# EasyEDA Pro project 5轴PCB-V1.1--捷配.eprj, schematic 原理图

## Sheets
1 主控MCU: Board Name: 控制板; Create Date: 2024-04-22; Page Name: 主控MCU; Project Name: 5轴PCB-V1.1--捷配; Schematic Name: 原理图; Update Date: 2025-03-28; Company: 嘉立创EDA; Page Size: A3; Version: V1.0
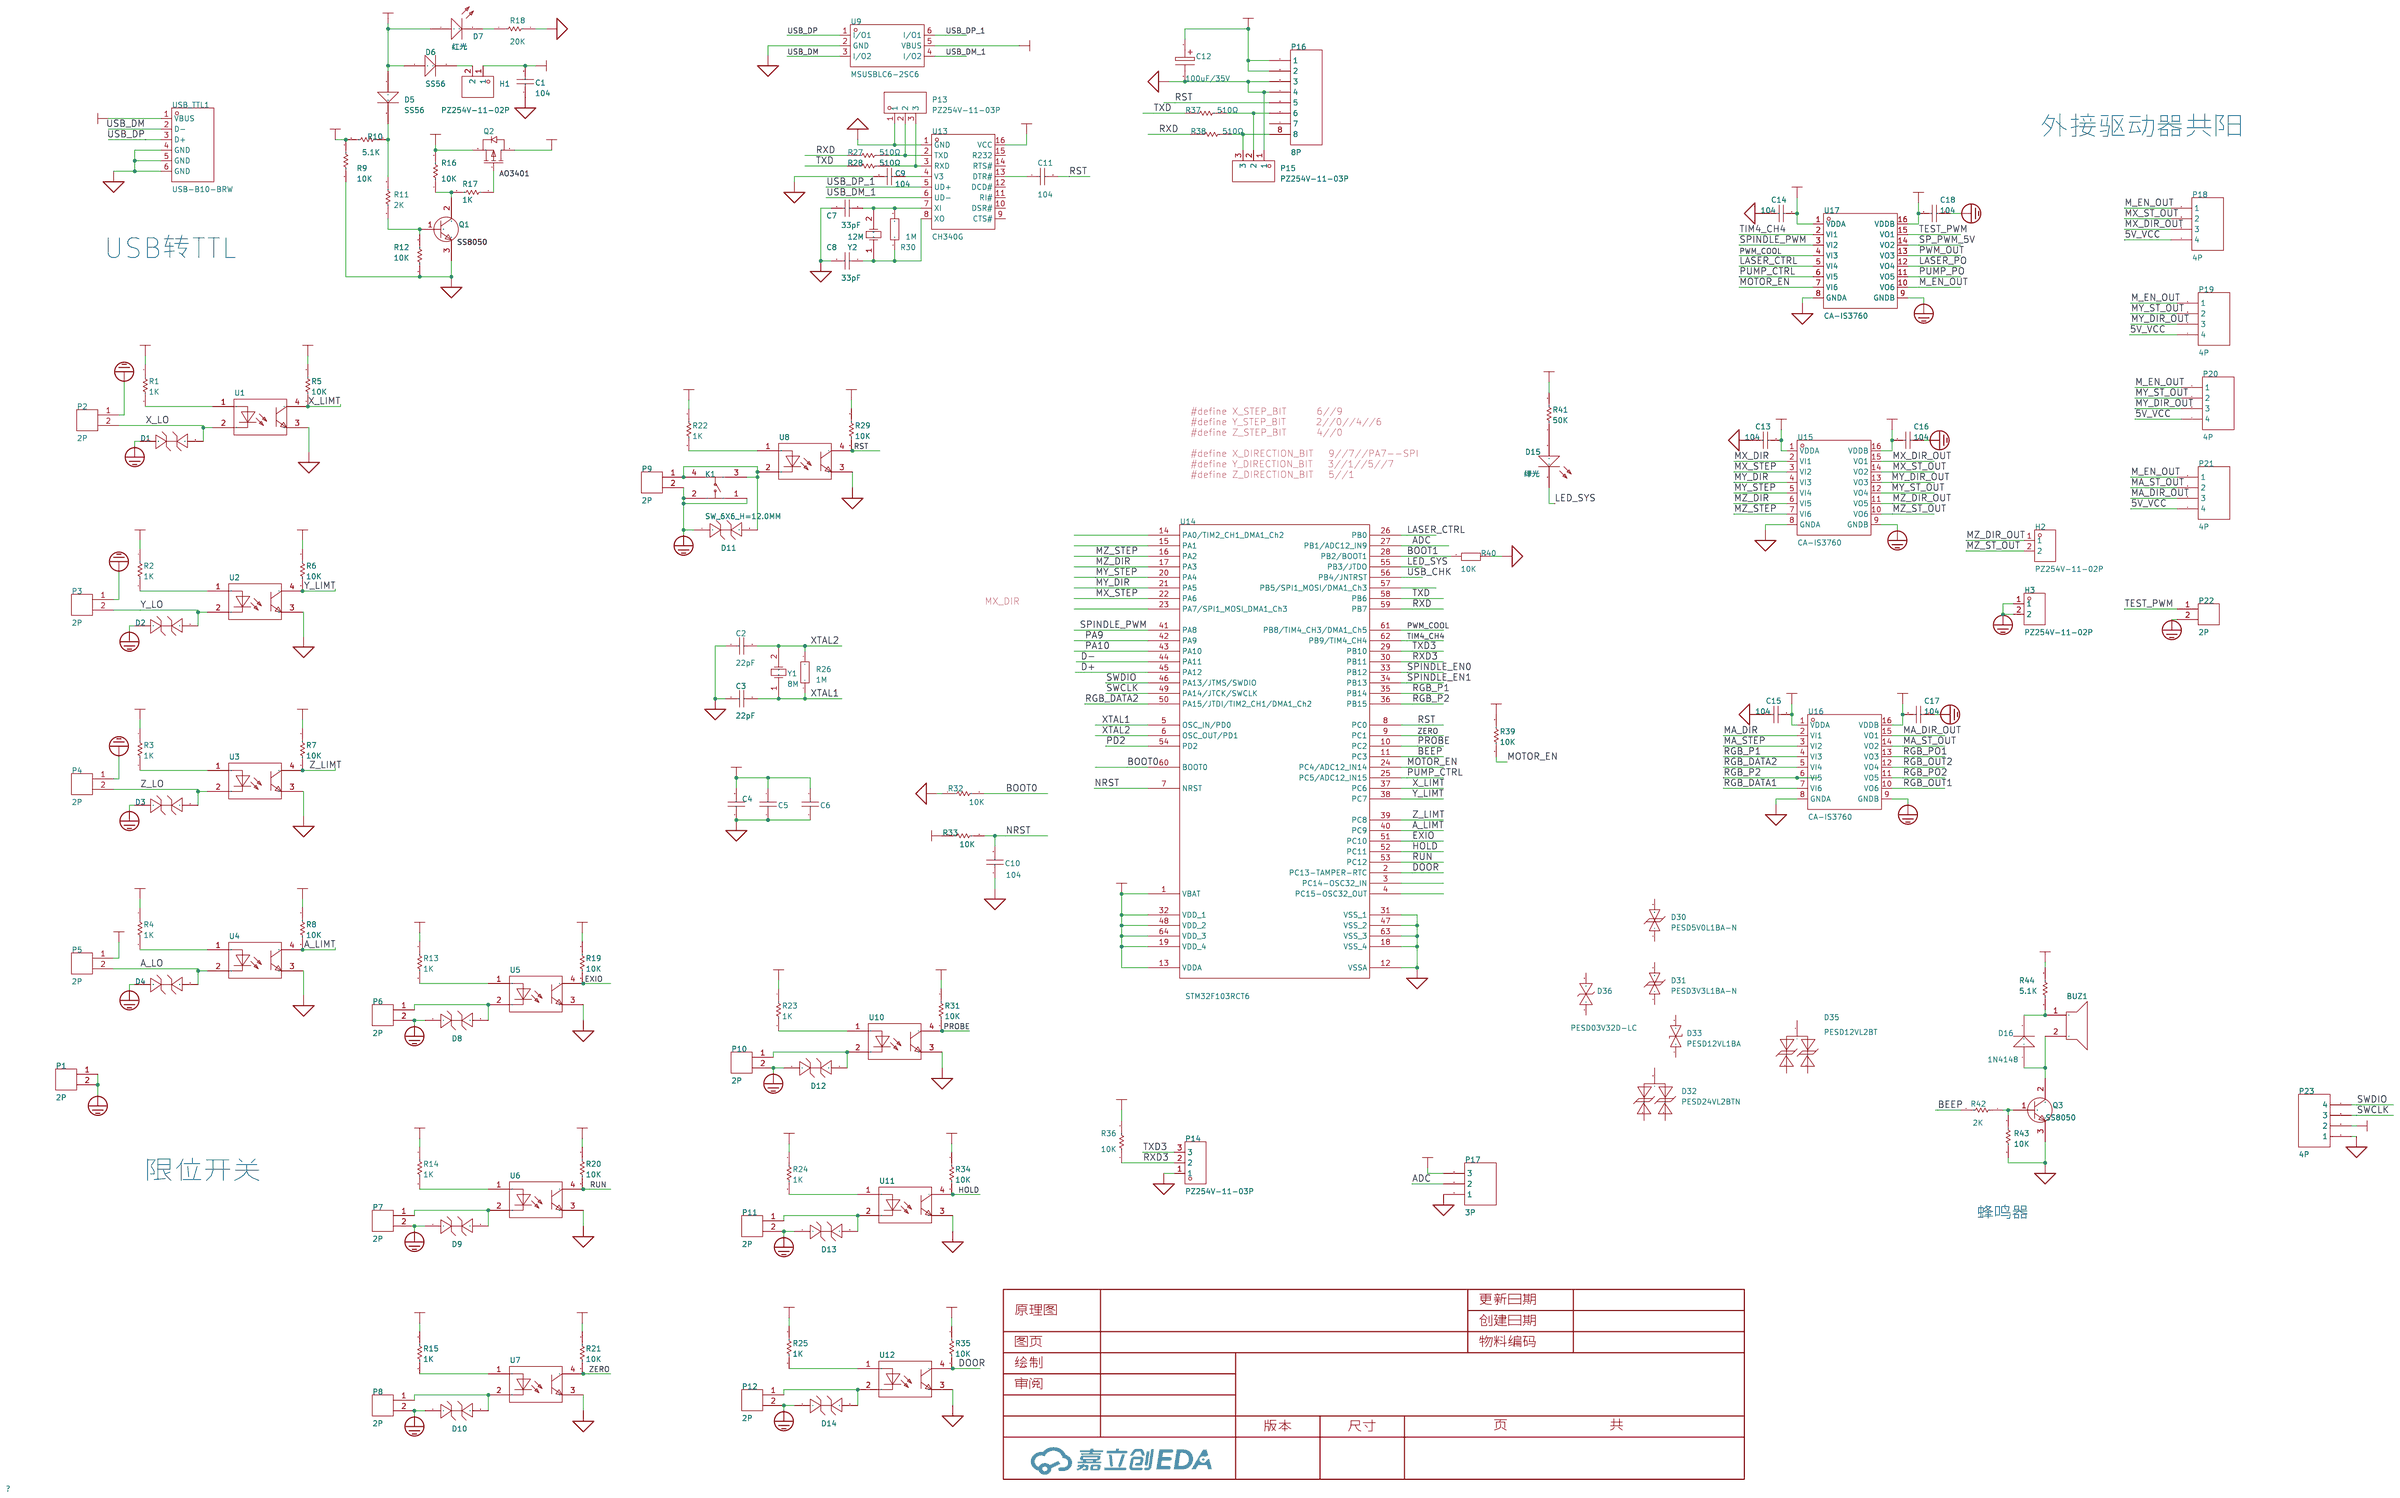
[diagram p0: 主控MCU]
2 电源及控制: Create Date: 2024-12-30; Page Name: 电源及控制; Update Date: 2025-01-02
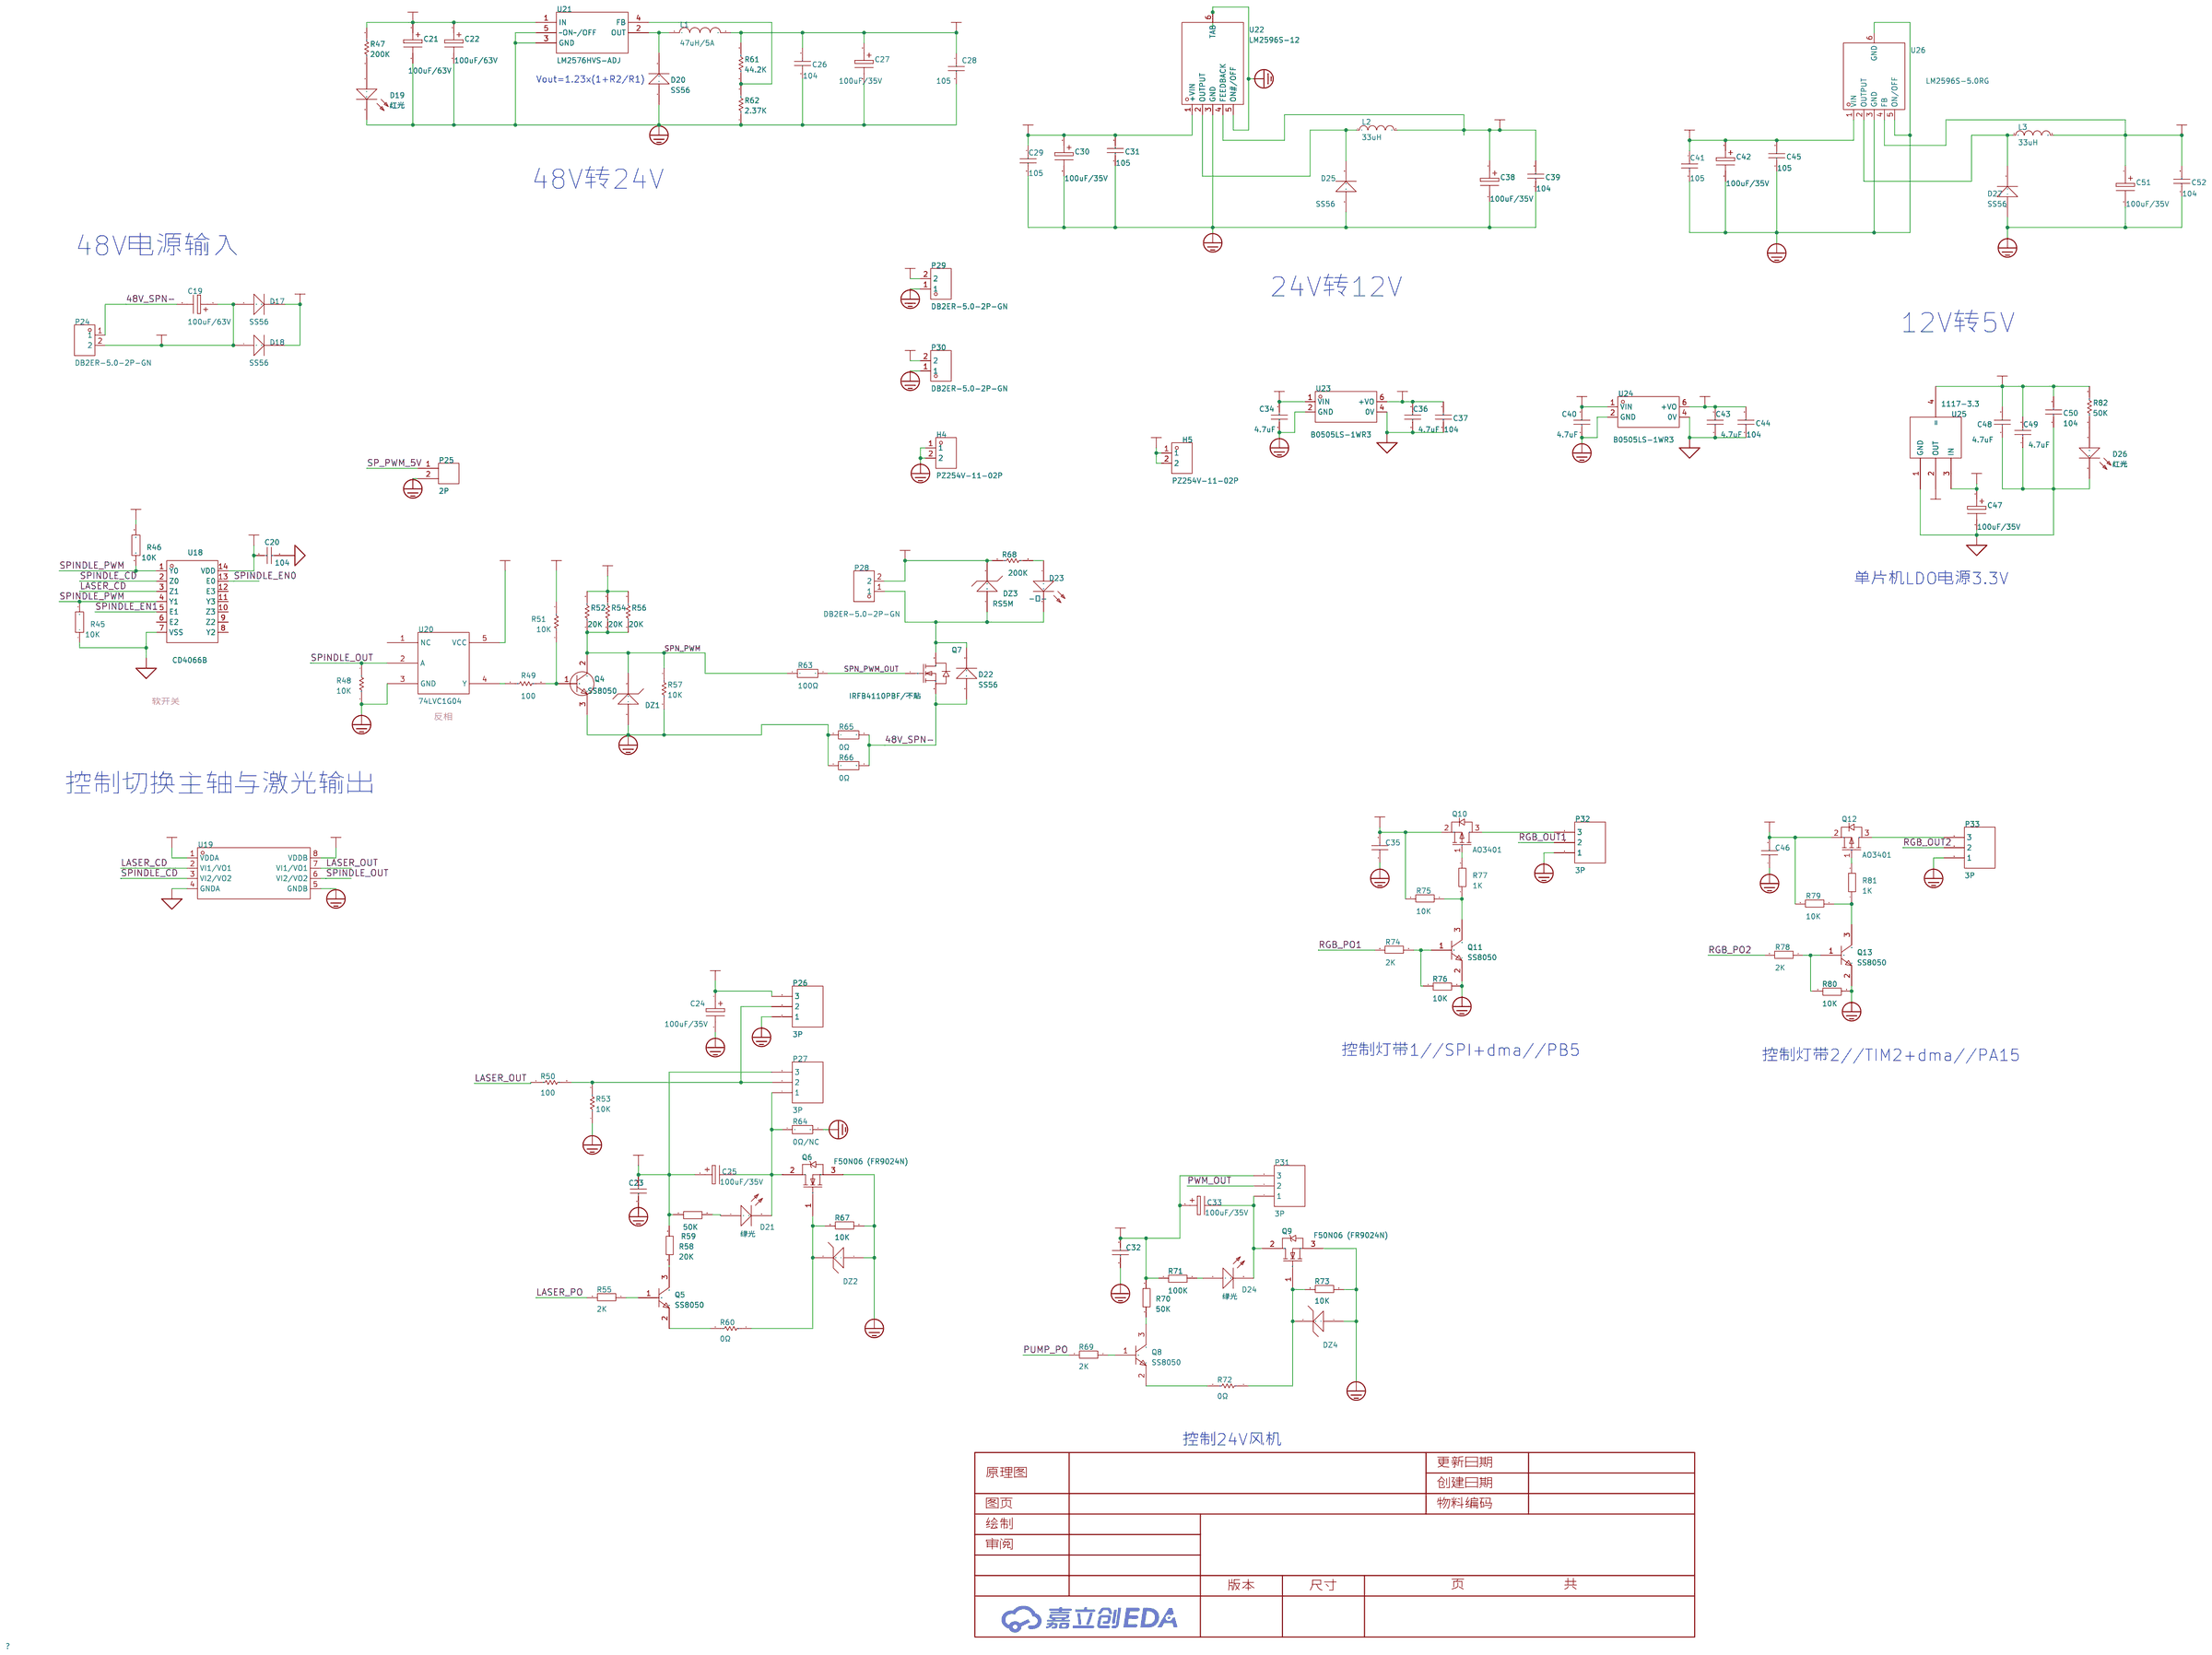
[diagram p1: 电源及控制]

## Parts
sheet 主控MCU
BUZ1  HNR-1255PA5.0  [BUZ-TH_BD12.5-P5.00-D0.9]
C1  104  [0603C]
C2  100pF  [0603C]
C3  100pF  [0603C]
C4  104  [0603C]
C5  104  [0603C]
C6  104  [0603C]
C7  18pF  [0603C]
C8  18pF  [0603C]
C9  104  [0603C]
C10  104  [0603C]
C11  104  [0805C]
C12  100uF/35V  [电解电容贴片6X6]
C13  104  [0603C]
C14  104  [0603C]
C15  104  [0603C]
C16  104  [0603C]
C17  104  [0603C]
C18  104  [0603C]
D1  ESD05V52D-C  [SOD-523_L1.2-W0.8-LS1.6-BI]
D2  ESD05V52D-C  [SOD-523_L1.2-W0.8-LS1.6-BI]
D3  ESD05V52D-C  [SOD-523_L1.2-W0.8-LS1.6-BI]
D4  ESD05V52D-C  [SOD-523_L1.2-W0.8-LS1.6-BI]
D5  SS56  [SMA]
D6  SS56  [SMA]
D7  红光  [0603LED]
D8  ESD05V52D-C  [SOD-523_L1.2-W0.8-LS1.6-BI]
D9  ESD05V52D-C  [SOD-523_L1.2-W0.8-LS1.6-BI]
D10  ESD05V52D-C  [SOD-523_L1.2-W0.8-LS1.6-BI]
D11  ESD05V52D-C  [SOD-523_L1.2-W0.8-LS1.6-BI]
D12  ESD05V52D-C  [SOD-523_L1.2-W0.8-LS1.6-BI]
D13  ESD05V52D-C  [SOD-523_L1.2-W0.8-LS1.6-BI]
D14  ESD05V52D-C  [SOD-523_L1.2-W0.8-LS1.6-BI]
D15  绿光  [0603LED]
D16  1N4148  [SMA]
D30  PESD5V0L1BA-N  [SOD-523_L1.2-W0.8-LS1.6-BI]
D31  PESD3V3L1BA-N  [SOD-523_L1.2-W0.8-LS1.6-BI]
D32  PESD24VL2BTN  [SOT-23-3_L2.9-W1.6-P1.90-LS2.8-BR]
D33  PESD12VL1BA  [SOD-323_L1.8-W1.3-LS2.5-BI]
D35  PESD12VL2BT  [SOT-23-3_L3.0-W1.7-P0.95-LS2.9-BR]
D36  PESD03V32D-LC  [SOD-323_L1.7-W1.3-LS2.5-BI]
H1  PZ254V-11-02P  [HDR-TH_2P-P2.54-V-M]
H2  PZ254V-11-02P  [HDR-TH_2P-P2.54-V-M]
H3  PZ254V-11-02P  [HDR-TH_2P-P2.54-V-M]
K1  SW_6X6_H=12.0MM  [KEY-SMD_4P-L6.0-W6.0-P4.50-LS9.0]
P1  2P  [HDR1X2_CON]
P2  2P  [HDR1X2_CON]
P3  2P  [HDR1X2_CON]
P4  2P  [HDR1X2_CON]
P5  2P  [HDR1X2_CON]
P6  2P  [HDR1X2_CON]
P7  2P  [HDR1X2_CON]
P8  2P  [HDR1X2_CON]
P9  2P  [HDR1X2_CON]
P10  2P  [HDR1X2_CON]
P11  2P  [HDR1X2_CON]
P12  2P  [HDR1X2_CON]
P13  PZ254V-11-03P  [HDR-TH_3P-P2.54-V-M]
P14  PZ254V-11-03P  [HDR-TH_3P-P2.54-V-M]
P15  PZ254V-11-03P  [HDR-TH_3P-P2.54-V-M]
P16  8P  [IDC8]
P17  3P  [HDR1X3_CON]
P18  4P  [HDR1X4_CON]
P19  4P  [HDR1X4_CON]
P20  4P  [HDR1X4_CON]
P21  4P  [HDR1X4_CON]
P22  2P  [HDR1X2_CON]
P23  4P  [SIP4]
Q1  SS8050  [SOT-23]
Q2  AO3401  [SOT-23-3_L3.0-W1.7-P0.95-LS2.9-BR]
Q3  SS8050  [SOT-23]
R1  1K  [0603R]
R2  1K  [0603R]
R3  1K  [0603R]
R4  1K  [0603R]
R5  10K  [0603R]
R6  10K  [0603R]
R7  10K  [0603R]
R8  10K  [0603R]
R9  10K  [0603R]
R10  5.1K  [0603R]
R11  2K  [0603R]
R12  10K  [0603R]
R13  1K  [0603R]
R14  1K  [0603R]
R15  1K  [0603R]
R16  10K  [0603R]
R17  1K  [0603R]
R18  20K  [0603R]
R19  10K  [0603R]
R20  10K  [0603R]
R21  10K  [0603R]
R22  1K  [0603R]
R23  1K  [0603R]
R24  1K  [0603R]
R25  1K  [0603R]
R26  1M  [R0603]
R27  510Ω  [0603R]
R28  510Ω  [0603R]
R29  10K  [0603R]
R30  1M  [R0603]
R31  10K  [0603R]
R32  10K  [0603R]
R33  10K  [0603R]
R34  10K  [0603R]
R35  10K  [0603R]
R36  10K  [0603R]
R37  510Ω  [0603R]
R38  510Ω  [0603R]
R39  10K  [0603R]
R40  10K  [0603R]
R41  50K  [0603R]
R42  2K  [0603R]
R43  10K  [0603R]
R44  5.1K  [0603R]
U1  LTV-357T-C  [SOP-4_L4.4-W3.9-P2.54-LS7.0-TL]
U2  LTV-357T-C  [SOP-4_L4.4-W3.9-P2.54-LS7.0-TL]
U3  LTV-357T-C  [SOP-4_L4.4-W3.9-P2.54-LS7.0-TL]
U4  LTV-357T-C  [SOP-4_L4.4-W3.9-P2.54-LS7.0-TL]
U5  LTV-357T-C  [SOP-4_L4.4-W3.9-P2.54-LS7.0-TL]
U6  LTV-357T-C  [SOP-4_L4.4-W3.9-P2.54-LS7.0-TL]
U7  LTV-357T-C  [SOP-4_L4.4-W3.9-P2.54-LS7.0-TL]
U8  LTV-357T-C  [SOP-4_L4.4-W3.9-P2.54-LS7.0-TL]
U9  MSUSBLC6-2SC6  [SOT-23-6_L2.9-W1.6-P0.95-LS2.8-BL]
U10  LTV-357T-C  [SOP-4_L4.4-W3.9-P2.54-LS7.0-TL]
U11  LTV-357T-C  [SOP-4_L4.4-W3.9-P2.54-LS7.0-TL]
U12  LTV-357T-C  [SOP-4_L4.4-W3.9-P2.54-LS7.0-TL]
U13  CH340G  [SOIC-16_L9.9-W3.9-P1.27-LS6.0-BL]
U14  STM32F103RCT6  [LQFP-64_L10.0-W10.0-P0.50-LS12.0-BL]
U15  CA-IS3760  [SOIC-16_L9.9-W3.9-P1.27-LS6.0-BL]
U16  CA-IS3760  [SOIC-16_L9.9-W3.9-P1.27-LS6.0-BL]
U17  CA-IS3760  [SOIC-16_L9.9-W3.9-P1.27-LS6.0-BL]
USB_TTL1  USB-B10-BRW  [USB-B-TH_USB-B10-BRW]
Y1  8M  [晶振贴片]
Y2  12M  [晶振贴片49SSMD]
sheet 电源及控制
C19  100uF/63V  [电解电容贴片10x10]
C20  104  [0603C]
C21  100uF/63V  [电解电容贴片10x10]
C22  100uF/63V  [电解电容贴片10x10]
C23  104  [0603C]
C24  100uF/35V  [电解电容贴片6X6]
C25  100uF/35V  [电解电容贴片6X6]
C26  104  [0805C]
C27  100uF/35V  [电解电容贴片6X6]
C28  105  [0805C]
C29  105  [0805C]
C30  100uF/35V  [电解电容贴片6x6]
C31  105  [0805C]
C32  104  [0603C]
C33  100uF/35V  [电解电容贴片6X6]
C34  4.7uF  [C0805]
C35  104  [0603C]
C36  4.7uF  [C0805]
C37  104  [C0603]
C38  100uF/35V  [电解电容贴片6x6]
C39  104  [C0603]
C40  4.7uF  [C0805]
C41  105  [C0603]
C42  100uF/35V  [电解电容贴片6x6]
C43  4.7uF  [C0805]
C44  104  [C0603]
C45  105  [C0603]
C46  104  [0603C]
C47  100uF/35V  [电解电容贴片6X6]
C48  4.7uF  [C0805]
C49  4.7uF  [C0805]
C50  104  [0603C]
C51  100uF/35V  [电解电容贴片6x6]
C52  104  [C0603]
D17  SS56  [SMA]
D18  SS56  [SMA]
D19  红光  [0603LED]
D20  SS56  [SMA]
D21  绿光  [0603LED]
D22  SS56  [SMA]
D23  -̹-  [0603LED]
D24  绿光  [0603LED]
D25  SS56  [SMA]
D26  红光  [0603LED]
D27  SS56  [SMA]
DZ1  --ѹ------SMAZ10V  [SMA]
DZ2  --ѹ------SMAZ10V  [SMA]
DZ3  RS5M  [SMC]
DZ4  --ѹ------SMAZ10V  [SMA]
H4  PZ254V-11-02P  [HDR-TH_2P-P2.54-V-M]
H5  PZ254V-11-02P  [HDR-TH_2P-P2.54-V-M]
L1  47uH/5A  [IND-SMD_L13.45-W12.6]
L2  33uH  [IND-SMD_L13.45-W12.6]
L3  33uH  [IND-SMD_L7.0-W7.0_SMDRI74-330MT]
P24  DB2ER-5.0-2P-GN  [CONN-TH_2P-P5.00_DB2ER-5.0-2P-GN]
P25  2P  [HDR1X2_CON]
P26  3P  [HDR1X3_CON]
P27  3P  [HDR1X3_CON]
P28  DB2ER-5.0-2P-GN  [CONN-TH_2P-P5.00_DB2ER-5.0-2P-GN]
P29  DB2ER-5.0-2P-GN  [CONN-TH_2P-P5.00_DB2ER-5.0-2P-GN]
P30  DB2ER-5.0-2P-GN  [CONN-TH_2P-P5.00_DB2ER-5.0-2P-GN]
P31  3P  [HDR1X3_CON]
P32  3P  [HDR1X3_CON]
P33  3P  [HDR1X3_CON]
Q4  SS8050  [SOT-23]
Q5  SS8050  [SOT-23]
Q6  F50N06 (FR9024N)  [TO-252]
Q7  IRFB4110PBF/不贴  [TO-220-3_L10.0-W4.5-P2.54-L]
Q8  SS8050  [SOT-23]
Q9  F50N06 (FR9024N)  [TO-252]
Q10  AO3401  [SOT-23]
Q11  SS8050  [SOT-23]
Q12  AO3401  [SOT-23]
Q13  SS8050  [SOT-23]
R45  10K  [R0603]
R46  10K  [R0603]
R47  10K  [0603R]
R48  10K  [0603R]
R49  100  [0603R]
R50  100  [0603R]
R51  10K  [0603R]
R52  20K  [0603R]
R53  10K  [0603R]
R54  20K  [0603R]
R55  2K  [0603R]
R56  20K  [0603R]
R57  10K  [0603R]
R58  20K  [0603R]
R59  50K  [0603R]
R60  0Ω  [0603R]
R61  44.2K  [0603R]
R62  2.37K  [0603R]
R63  100Ω  [R0603]
R64  0Ω/NC  [R1210]
R65  0Ω  [R1210]
R66  0Ω  [R1210]
R67  10K  [0603R]
R68  200K  [0603R]
R69  2K  [0603R]
R70  50K  [0603R]
R71  100K  [0603R]
R72  0Ω  [0603R]
R73  10K  [0603R]
R74  2K  [0603R]
R75  10K  [0603R]
R76  10K  [0603R]
R77  1K  [0603R]
R78  2K  [0603R]
R79  10K  [0603R]
R80  10K  [0603R]
R81  1K  [0603R]
R82  50K  [0603R]
U18  CD4066B  [SOP-14_L8.6-W3.9-P1.27-LS6.0-BL]
U19  CA-IS3720LS  [SOIC-8_L4.9-W3.9-P1.27-LS6.0-BL]
U20  74LVC1G04  [SOT-23-5]
U21  LM2576HVS-ADJ  [TO-263]
U22  LM2596S-12  [TO-263-5_L10.2-W8.6-P1.70-LS14.4-BR]
U23  B0505LS-1WR3  [PWRM-TH_BXXXXLS-1WR3]
U24  B0505LS-1WR3  [PWRM-TH_BXXXXLS-1WR3]
U25  1117-3.3  [SOT-223]
U26  LM2596S-5.0RG  [TO-263-5_L10.1-W8.7-P1.70-LS15.2-BR]

## Library data of the parts
BUZ1 = HNR-1255PA5.0: Supplier Part: C22387764; Manufacturer: 华能; Supplier Footprint: 插件,D=12.5mm; Datasheet: https://atta.szlcsc.com/upload/public/pdf/source/20240511/4CF3735ACB8587B052B696B4D6D2AF15.pdf; Supplier: LCSC
C1 C20 C50 = 104: Capacitor (Semiconductor SIM Model); Published: 8-Jun-2000; LatestRevisionDate: 17-Jul-2002; LatestRevisionNote: Re-released for DXP Platform.; PackageReference: C1206; Publisher: Altium Limited; Origin Footprint 2: C1206; Origin Footprint 3: 0402; Origin Footprint 4: 1310[0504]; Origin Footprint 5: 1608[0603]; Origin Footprint 6: C1210; Origin Footprint 7: C0805; Origin Footprint 8: C1206; Origin Footprint 9: 0805; Origin Footprint 10: 0805L; Design Item ID: Cap Semi; Library Name: Miscellaneous Devices
C2 C3 = 22pF: Capacitor (Semiconductor SIM Model); Published: 8-Jun-2000; LatestRevisionDate: 17-Jul-2002; LatestRevisionNote: Re-released for DXP Platform.; PackageReference: C1206; Publisher: Altium Limited; Origin Footprint 2: C1206; Origin Footprint 3: 0402; Origin Footprint 4: 1310[0504]; Origin Footprint 5: 1608[0603]; Origin Footprint 6: C1210; Origin Footprint 7: C0805; Origin Footprint 8: C1206; Origin Footprint 9: 0805; Origin Footprint 10: 0805L; Origin Footprint 11: 0805C; Design Item ID: Cap Semi; Library Name: Miscellaneous Devices
C4-C6 C23 C32 C35 C46 = 104: Origin Footprint 2: CAP; Origin Footprint 3: 0805C; Design Item ID: CAP; Library Name: SCH封装库
C7 C8 = 33pF: Capacitor (Semiconductor SIM Model); Published: 8-Jun-2000; LatestRevisionDate: 17-Jul-2002; LatestRevisionNote: Re-released for DXP Platform.; PackageReference: C1206; Publisher: Altium Limited; Origin Footprint 2: C1206; Origin Footprint 3: 0402; Origin Footprint 4: 1310[0504]; Origin Footprint 5: 1608[0603]; Origin Footprint 6: C1210; Origin Footprint 7: C0805; Origin Footprint 8: C1206; Origin Footprint 9: 0805; Origin Footprint 10: 0805L; Design Item ID: Cap Semi; Library Name: Miscellaneous Devices
C9 = 103: Capacitor (Semiconductor SIM Model); Published: 8-Jun-2000; LatestRevisionDate: 17-Jul-2002; LatestRevisionNote: Re-released for DXP Platform.; PackageReference: C1206; Publisher: Altium Limited; Origin Footprint 2: C1206; Origin Footprint 3: 0402; Origin Footprint 4: 1310[0504]; Origin Footprint 5: 1608[0603]; Origin Footprint 6: C1210; Origin Footprint 7: C0805; Origin Footprint 8: C1206; Origin Footprint 9: 0805; Origin Footprint 10: 0805L; Design Item ID: Cap Semi; Library Name: Miscellaneous Devices
C10 C13-C18 = 104: Capacitor (Semiconductor SIM Model); Published: 8-Jun-2000; LatestRevisionDate: 17-Jul-2002; LatestRevisionNote: Re-released for DXP Platform.; PackageReference: C1206; Publisher: Altium Limited; Origin Footprint 2: C1206; Origin Footprint 3: 0402; Origin Footprint 4: 1310[0504]; Origin Footprint 5: 1608[0603]; Origin Footprint 6: C1210; Origin Footprint 7: C0805; Origin Footprint 8: C1206; Origin Footprint 9: 0805; Origin Footprint 10: 0805L; Origin Footprint 11: 0805C; Design Item ID: Cap Semi; Library Name: Miscellaneous Devices
C11 = 104: Capacitor (Semiconductor SIM Model); Published: 8-Jun-2000; LatestRevisionDate: 17-Jul-2002; LatestRevisionNote: Re-released for DXP Platform.; PackageReference: C1206; Publisher: Altium Limited; Origin Footprint 2: C1206; Origin Footprint 3: 0402; Origin Footprint 4: 1310[0504]; Origin Footprint 5: 1608[0603]; Origin Footprint 6: C1210; Origin Footprint 7: C0805; Origin Footprint 8: C1206; Origin Footprint 9: 0805; Origin Footprint 10: 0805L; Origin Footprint 1: 0603C; Design Item ID: Cap Semi; Library Name: Miscellaneous Devices
C12 C24 C25 C27 C33 C47 = 100uF/35V: Origin Footprint 2: X47U; Origin Footprint 1: 电解电容贴片6x6; Design Item ID: ELECTRO1; Library Name: *
D1-D4 D8-D14 = ESD05V52D-C: 极性：双向 反向截止电压(Vrwm)：5V 击穿电压(VBR)：5.6V 钳位电压(Vc)@Ipp：15V 反向截止电压(Vrwm)：5V 击穿电压(最小值)：5.6V 峰值脉冲电流(Ipp)@tp=8/20μs：5A 最大钳位电压：15V; Supplier Part: C727170; Manufacturer: TWGMC(台湾迪嘉); Supplier Footprint: SOD-523; JLCPCB Part Class: 扩展库; Datasheet: https://atta.szlcsc.com/upload/public/pdf/source/20200827/C727170_700AFDE065FF081A69A0C04747B3686A.pdf; Supplier: LCSC
D5 D6 D17 D18 D20 = SS56: Design Item ID: 1N4148; Library Name: SCH封装库
D7 D19 D26 = 红光: Origin Footprint 2: LED(小); Design Item ID: LED; Library Name: SCH封装库
D15 D21 D24 = 绿光: Origin Footprint 2: LED(小); Design Item ID: LED; Library Name: SCH封装库
D16 = 4148: Library Name: SCH封装库
D30 D31 = PESD5V0S1BBN: 极性:Bidirectional;反向关断电压（典型值）:5V (Max);击穿电压（最小值）:6V;箝位电压:15V;峰值脉冲电流（10/1000us）:5A (8/20us);; Supplier Part: C314264; Manufacturer: BORN伯恩半导体; Supplier Footprint: SOD-523; JLCPCB Part Class: Extended Part; Datasheet: https://atta.szlcsc.com/upload/public/pdf/source/20181015/C314264_F9AC5761AC2631DA841FBD1D9C6821E3.pdf; Supplier: LCSC; Polarity: Bidirectional; Voltage - Reverse Standoff (Typ): 5V (Max); Voltage - Breakdown (Min): 6V; Voltage - Clamping (Max) @ Ipp: 15V; Current - Peak Pulse (10/1000μs): 5A (8/20us)
D32 = PESD24VL2BTN: 极性:Bidirectional;反向关断电压（典型值）:24V (Max);击穿电压（最小值）:26.7V;箝位电压:48V;峰值脉冲电流（10/1000us）:6A (8/20us);; Supplier Part: C314266; Manufacturer: BORN伯恩半导体; Supplier Footprint: SOT-23; JLCPCB Part Class: Extended Part; Datasheet: https://atta.szlcsc.com/upload/public/pdf/source/20181015/C314266_827961A24CE19193E9C29A410C67A84F.pdf; Supplier: LCSC; Polarity: Bidirectional; Voltage - Reverse Standoff (Typ): 24V (Max); Voltage - Breakdown (Min): 26.7V; Voltage - Clamping (Max) @ Ipp: 48V; Current - Peak Pulse (10/1000μs): 6A (8/20us)
D33 = PESD12VL1BA: 极性:Bidirectional;峰值脉冲电流（10/1000us）:15A (8/20us);箝位电压:35V;击穿电压（最小值）:13.3V;反向关断电压（典型值）:12V (Max);; LCSC Part Name: ESD二极管 PESD12VL1BA; Supplier Part: C323796; Supplier Footprint: SOD-323; JLCPCB Part Class: Extended Part; Datasheet: https://atta.szlcsc.com/upload/public/pdf/source/20181106/C323796_786395A6D23F4A10D2996BFA6C9A4EF4.pdf; Supplier: LCSC
D35 = PESD15VL2BT-N: SOT-23 15V    双向 静电TVS PCAN/串口; Supplier Part: C316024; Manufacturer: BORN伯恩半导体; Supplier Footprint: SOT-23; JLCPCB Part Class: Extended Part; Datasheet: https://atta.szlcsc.com/upload/public/pdf/source/20181026/C316024_6CEDF6D2EA64D8D3D4C2B14D7EFDCED2.pdf; Supplier: LCSC
D36 = PESD03V32D-LC: 极性:双向;反向截止电压(Vrwm):3.3V;最大钳位电压:16V;击穿电压:4V;; Supplier Part: C2912528; Manufacturer: TECH PUBLIC(台舟); Supplier Footprint: SOD-323; JLCPCB Part Class: 扩展库; Datasheet: https://atta.szlcsc.com/upload/public/pdf/source/20211102/817A196708C9E8A6CC27A16BC0CC1C1B.pdf; Supplier: LCSC; polarity: 双向; Reverse Stand-Off Voltage (Vrwm): 3.3V; Maximum Clamping Voltage: 16V; Breakdown Voltage: 4V; Reverse Leakage Current (Ir): 200nA; Number of Lines: 单路
H1-H5 = PZ254V-11-02P: 插针结构:1x2P;间距:2.54mm;行距:-;圆针/方针:方针;安装类型:直插;排数:单排;总PIN位数:2P;额定电流:-;额定电压:-;配合针长度:6mm;塑高:2.5mm;端接针长度:3mm;触头材质:黄铜;触头镀层:-;工作温度范围:-40℃~+105℃;颜色:黑色;; LCSC Part Name: 间距:2.54mm 1x2P 直插 方针; Supplier Part: C492401; Manufacturer: XFCN(兴飞); Supplier Footprint: 插件,P=2.54mm; JLCPCB Part Class: 扩展库; Datasheet: https://atta.szlcsc.com/upload/public/pdf/source/20200309/C492401_A812433581A9B211A7FFA413ADDFF0E5.pdf; Supplier: LCSC; Pin Structure: 1x2P; Pitch: 2.54mm; Circluar Pins/Square Pins: 方针; Mounting Type: 直插; Number of Rows: 单排; Number of Pins: 2P; Length of Mating Pin: 6mm; Insulation Height: 2.5mm; Length of End Connection Pin: 3mm; Contact Material: 黄铜; Operating Temperature Range: -40℃~+105℃; Color: 黑色
K1 = SW_6X6_H=12.0MM: Supplier Part: C9900018802; Supplier Footprint: KEY-SMD; JLCPCB Part Class: 扩展库; Supplier: LCSC
P1-P12 P22 P25 = 2P: Library Name: SCH--װ--
P13-P15 = PZ254V-11-03P: 插针结构:1x3P;间距:2.54mm;行距:-;圆针/方针:方针;安装类型:直插;排数:单排;总PIN位数:3P;额定电流:3A;额定电压:250V;配合针长度:6mm;塑高:2.5mm;端接针长度:3mm;工作温度范围:-40℃~+105℃;颜色:黑色;; LCSC Part Name: 间距:2.54mm 1x3P 直插 方针; Supplier Part: C2937625; Manufacturer: XFCN(兴飞); Supplier Footprint: 插件,P=2.54mm; JLCPCB Part Class: 扩展库; Datasheet: https://atta.szlcsc.com/upload/public/pdf/source/20200309/C492402_8335C3D49C4E4C618838D59BB1D024C1.pdf; Supplier: LCSC; Pin Structure: 1x3P; Pitch: 2.54mm; Circluar Pins/Square Pins: 方针; Mounting Type: 直插; Number of Rows: 单排; Number of Pins: 3P; Current Rating (Max): 3A; Voltage Rating (Max): 250V; Length of Mating Pin: 6mm; Insulation Height: 2.5mm; Length of End Connection Pin: 3mm; Operating Temperature Range: -40℃~+105℃; Color: 黑色
P16 = 8P: Library Name: SCH封装库
P17 P26 P27 P31-P33 = 3P: Library Name: SCH封装库
P18-P21 = 4P: Library Name: SCH封装库
P23 = 4P: Library Name: SCH--װ--
Q1 Q4 = SS8050: Published: 8-Jun-2000; LatestRevisionDate: 17-Jul-2002; LatestRevisionNote: Re-released for DXP Platform.; PackageReference: TO-226; Publisher: Altium Limited; Code_JEDEC: TO-226-AA; Origin Footprint 2: TO-92; Design Item ID: NPN; Library Name: SCH--װ--
Q2 = SI2301CDS-T1-GE3: 类型:1个P沟道;漏源电压(Vdss):20V;连续漏极电流(Id):3.1A;功率(Pd):860mW；1.6W;导通电阻(RDS(on)@Vgs,Id):112mΩ@4.5V,2.8A;阈值电压(Vgs(th)@Id):1V@250uA;; LCSC Part Name: 1个P沟道耐压:20V电流:3.1A; Supplier Part: C10487; Manufacturer: VISHAY(威世); Supplier Footprint: SOT-23; JLCPCB Part Class: 基础库; Datasheet: https://atta.szlcsc.com/upload/public/pdf/source/20180621/C10487_757133A2CC00440C4C7DD3E7E73681E9.pdf; Supplier: LCSC; Type: 1个P沟道; Drain Source Voltage (Vdss): 20V; Continuous Drain Current (Id): 3.1A; Power Dissipation (Pd): 860mW；1.6W; Drain Source On Resistance (RDS(on)@Vgs,Id): 112mΩ@4.5V,2.8A; Gate Threshold Voltage (Vgs(th)@Id): 1V@250uA; Total Gate Charge (Qg@Vgs): 10nC@4.5V; Input Capacitance (Ciss@Vds): 405pF@10V; Operating Temperature: -55℃~+150℃@(Tj)
Q3 = SS8050: Published: 8-Jun-2000; LatestRevisionDate: 17-Jul-2002; LatestRevisionNote: Re-released for DXP Platform.; PackageReference: TO-226; Publisher: Altium Limited; Code_JEDEC: TO-226-AA; Origin Footprint 2: TO-92; Design Item ID: NPN; Library Name: SCH封装库
R1-R4 R13-R15 R22-R25 = 470Ω: Resistor; Published: 8-Jun-2000; LatestRevisionDate: 17-Jul-2002; LatestRevisionNote: Re-released for DXP Platform.; PackageReference: AXIAL-0.3; Publisher: Altium Limited; Origin Footprint 2: AXIAL-0.3; Origin Footprint 3: R0805; Origin Footprint 4: 0805R; Design Item ID: RES; Library Name: SCH封装库
R5-R8 R19-R21 R29 R31 R34 R35 R47 = 10K: Resistor; Published: 8-Jun-2000; LatestRevisionDate: 17-Jul-2002; LatestRevisionNote: Re-released for DXP Platform.; PackageReference: AXIAL-0.3; Publisher: Altium Limited; Origin Footprint 2: AXIAL-0.3; Origin Footprint 3: R0805; Origin Footprint 4: 0805R; Design Item ID: RES; Library Name: SCH封装库
R9 = 1.8K: Resistor; Published: 8-Jun-2000; LatestRevisionDate: 17-Jul-2002; LatestRevisionNote: Re-released for DXP Platform.; PackageReference: AXIAL-0.3; Publisher: Altium Limited; Origin Footprint 2: AXIAL-0.3; Origin Footprint 3: R0805; Design Item ID: RES; Library Name: SCH封装库
R10 = 1K?: Resistor; Published: 8-Jun-2000; LatestRevisionDate: 17-Jul-2002; LatestRevisionNote: Re-released for DXP Platform.; PackageReference: AXIAL-0.3; Publisher: Altium Limited; Origin Footprint 2: AXIAL-0.3; Origin Footprint 3: R0805; Design Item ID: RES; Library Name: SCH封装库
R11 R12 R16 R48 R51 R53 R57 R68 = 10K: Resistor; Published: 8-Jun-2000; LatestRevisionDate: 17-Jul-2002; LatestRevisionNote: Re-released for DXP Platform.; PackageReference: AXIAL-0.3; Publisher: Altium Limited; Origin Footprint 2: AXIAL-0.3; Origin Footprint 3: R0805; Origin Footprint 4: 0805R; Design Item ID: RES; Library Name: SCH--װ--
R17 R52 R54 R56 = 1K: Resistor; Published: 8-Jun-2000; LatestRevisionDate: 17-Jul-2002; LatestRevisionNote: Re-released for DXP Platform.; PackageReference: AXIAL-0.3; Publisher: Altium Limited; Origin Footprint 2: AXIAL-0.3; Origin Footprint 3: R0805; Origin Footprint 4: 0805R; Design Item ID: RES; Library Name: SCH--װ--
R18 = 1K: Resistor; Published: 8-Jun-2000; LatestRevisionDate: 17-Jul-2002; LatestRevisionNote: Re-released for DXP Platform.; PackageReference: AXIAL-0.3; Publisher: Altium Limited; Origin Footprint 2: AXIAL-0.3; Origin Footprint 3: R0805; Design Item ID: RES; Library Name: SCH封装库
R26 R30 R45 R46 R63 = Res_0603: Supplier Footprint: 0603
R27 = 680!!: Resistor; Published: 8-Jun-2000; LatestRevisionDate: 17-Jul-2002; LatestRevisionNote: Re-released for DXP Platform.; PackageReference: AXIAL-0.3; Publisher: Altium Limited; Origin Footprint 2: AXIAL-0.3; Origin Footprint 3: R0805; Origin Footprint 4: 0805R; Design Item ID: RES; Library Name: SCH封装库
R28 R37 R38 R50 = 100: Resistor; Published: 8-Jun-2000; LatestRevisionDate: 17-Jul-2002; LatestRevisionNote: Re-released for DXP Platform.; PackageReference: AXIAL-0.3; Publisher: Altium Limited; Origin Footprint 2: AXIAL-0.3; Origin Footprint 3: R0805; Origin Footprint 4: 0805R; Design Item ID: RES; Library Name: SCH封装库
R32 R33 = 10K: Resistor; Published: 8-Jun-2000; LatestRevisionDate: 17-Jul-2002; LatestRevisionNote: Re-released for DXP Platform.; PackageReference: AXIAL-0.3; Publisher: Altium Limited; Origin Footprint 2: AXIAL-0.3; Origin Footprint 3: 0805R; Origin Footprint 4: 0805R; Design Item ID: RES; Library Name: SCH封装库
R36 R39 = RES: Resistor; Published: 8-Jun-2000; LatestRevisionDate: 17-Jul-2002; LatestRevisionNote: Re-released for DXP Platform.; PackageReference: AXIAL-0.3; Publisher: Altium Limited; Origin Footprint 2: AXIAL-0.3; Origin Footprint 3: 0805R; Library Name: SCH封装库
R40 = 10K: Origin Footprint 2: res; Origin Footprint 3: RES2; Origin Footprint 4: AXIAL-0.4; Origin Footprint 1: 0805R; Design Item ID: res; Library Name: MYLIB
R41 R82 = 1K: Resistor; Published: 8-Jun-2000; LatestRevisionDate: 17-Jul-2002; LatestRevisionNote: Re-released for DXP Platform.; PackageReference: AXIAL-0.3; Publisher: Altium Limited; Origin Footprint 2: AXIAL-0.3; Origin Footprint 3: R0805; Origin Footprint 4: 0805R; Design Item ID: RES; Library Name: SCH封装库
R42 = 2K: Resistor; Published: 8-Jun-2000; LatestRevisionDate: 17-Jul-2002; LatestRevisionNote: Re-released for DXP Platform.; PackageReference: AXIAL-0.3; Publisher: Altium Limited; Origin Footprint 2: AXIAL-0.3; Origin Footprint 3: R0805; Design Item ID: RES; Library Name: SCH封装库
R43 = 100: Resistor; Published: 8-Jun-2000; LatestRevisionDate: 17-Jul-2002; LatestRevisionNote: Re-released for DXP Platform.; PackageReference: AXIAL-0.3; Publisher: Altium Limited; Origin Footprint 2: AXIAL-0.3; Origin Footprint 3: R0805; Design Item ID: RES; Library Name: SCH封装库
R44 = 4.7K: Resistor; Published: 8-Jun-2000; LatestRevisionDate: 17-Jul-2002; LatestRevisionNote: Re-released for DXP Platform.; PackageReference: AXIAL-0.3; Publisher: Altium Limited; Origin Footprint 2: AXIAL-0.3; Origin Footprint 3: R0805; Origin Footprint 4: 0805R; Design Item ID: RES; Library Name: SCH封装库
U1-U8 U10-U12 = LTV-357T-C: 输入电压类型:DC;正向电压:1.2V;输出电流:50mA;隔离电压(rms):3.75kV;反向电压:6V;接收端电压:35V;输出通道数:1;集射极饱和电压(Vce(sat)@Ic,IF):200mV@1mA,20mA;; Supplier: LCSC; Manufacturer: LITEON(光宝); Supplier Part: C119091; JLCPCB Part Class: 扩展库; LCSC Part Name: DC输入隔离电压(rms):3750V; Supplier Footprint: SOP-4-2.54mm; Datasheet: https://atta.szlcsc.com/upload/public/pdf/source/20170930/C133128_1506736380934997376.pdf; Input voltage type: DC; Output Type: 光电三极管; Forward Voltage: 1.2V; Output Current: 50mA; Isolation Voltage(rms): 3.75kV; Reverse Voltage: 6V; Receiving End Voltage: 35V; Number of Outputs: 1; Collector-Emitter Saturation Voltage (Vce(sat)@Ic,IF): 200mV@1mA,20mA; Rise time: 4us@2mA,100Ω; Fall time: 3us@2mA,100Ω; Operating Temperature: -55℃~+110℃
U9 = MSUSBLC6-2SC6: 反向截止电压(Vrwm):5V;最大钳位电压:15V;峰值脉冲电流(Ipp)@10/1000us:6A;峰值脉冲功率(Ppp)@10/1000us:150W;击穿电压:9V;; LCSC Part Name: UL26; Supplier Part: C2830148; Manufacturer: MSKSEMI(美森科); Supplier Footprint: SOT-23-6; JLCPCB Part Class: 扩展库; Datasheet: https://atta.szlcsc.com/upload/public/pdf/source/20210623/C2830148_830D5495FDC11AF9D5769967D4D0CCFD.pdf; Supplier: LCSC; Reverse Stand-Off Voltage (Vrwm): 5V; Maximum Clamping Voltage: 15V; Peak Pulse Current (Ipp)@10/1000us: 6A; Peak Pulse Power Dissipation (Ppp)@10/1000us: 150W; Breakdown Voltage: 9V; Type: ESD
U13 = CH340G: 应用功能:收发器;接口协议:USB 2.0;数据速率:2Mbps;; LCSC Part Name: USB转串口芯片 CH340; Supplier Part: C14267; Manufacturer: WCH(南京沁恒); Supplier Footprint: SOP-16; JLCPCB Part Class: 扩展库; Datasheet: https://atta.szlcsc.com/upload/public/pdf/source/20230530/6E401E9554E9F5311886CC8B3F89B62E.pdf; Supplier: LCSC; Applications Function: 收发器; Protocol: USB 2.0; Supply Voltage: 3.3V；5V; Data Rate: 2Mbps
U14 = STM32F103RBT6: STM32 ARM-based 32-bit MCU with 128 Kbytes Flash, 64-pin LQFP, Industrial Temperature; Published: 30-May-2008; DatasheetVersion: rev6, Mar-2008; PackageVersion: Mar-2008; PackageReference: LQFP64; Publisher: Altium Limited; PackageDescription: 64-Pin Low-Profile Quad Flat Pack, 10 x 10 mm Body, 0.5 mm Pitch (LQFP64); ComponentLink1Description: Manufacturer Link; ComponentLink1URL: www.st.com/stm32; ComponentLink2Description: Datasheet; ComponentLink2URL: http://www.st.com/stonline/products/literature/ds/13587.pdf; Origin Footprint 2: LQFP64_L; Origin Footprint 3: LQFP64_M; Origin Footprint 1: LQFP-64; Library Name: ST Microcontroller 32-Bit STM32; Datasheet: http://www.st.com/stonline/products/literature/ds/13587.pdf
U15-U17 = CA-IS3760HN: LCSC Part Name: CA‐IS376x 高速六通道数字隔离器; Supplier Part: C19723481; Manufacturer: Chipanalog(川土微); Supplier Footprint: SOIC-16-NB; JLCPCB Part Class: 扩展库; Datasheet: https://atta.szlcsc.com/upload/public/pdf/source/20231222/0EEB57886E3672BACB4CFC71CD69856C.pdf; Supplier: LCSC
USB_TTL1 = USB-B10-BRW: 连接器类型:Type-B;标准:USB 2.0;公母:母;端口数量:1;触点数量:4P;安装方式:弯插;额定电流 - 电源:1.5A;工作温度范围:-20℃~+70℃;焊接温度(最大值):260℃;; LCSC Part Name: Type-B母弯插; Supplier Part: C720549; Manufacturer: XUNPU(讯普); Supplier Footprint: 插件; JLCPCB Part Class: 扩展库; Datasheet: https://atta.szlcsc.com/upload/public/pdf/source/20200812/C720549_53E9294752E2933874870440E626C579.pdf; Supplier: LCSC; Connector Type: Type-B; Standard: USB2.0; Gender: 母; Number of Ports: 1; Number of Contacts: 4P; Mounting Style: 弯插; Current Rating - Power (Max): 1.5A; Operating Temperature Range: -20℃~+70℃; Soldering Temperature(Max): 260℃
Y1 = 8M: Crystal Oscillator; Published: 8-Jun-2000; LatestRevisionDate: 17-Jul-2002; LatestRevisionNote: Re-released for DXP Platform.; PackageReference: R38; Publisher: Altium Limited; Origin Footprint 2: R38; Origin Footprint 3: XTAL-49S; Design Item ID: XTAL; Library Name: Miscellaneous Devices
Y2 = 12M: Crystal Oscillator; Published: 8-Jun-2000; LatestRevisionDate: 17-Jul-2002; LatestRevisionNote: Re-released for DXP Platform.; PackageReference: R38; Publisher: Altium Limited; Origin Footprint 2: R38; Origin Footprint 3: XTAL-49S; Design Item ID: XTAL; Library Name: Miscellaneous Devices
C19 C21 C22 = 100uF/63V: Origin Footprint 2: X47U; Design Item ID: ELECTRO1; Library Name: *
C26 = 104: Origin Footprint 2: CAP; Design Item ID: CAP; Library Name: SCH封装库
C28 = 105: Design Item ID: CAP; Library Name: SCH封装库
C29 C31 C41 C45 = 105: Design Item ID: CAP; Library Name: SCH--װ--
C30 C38 C42 C51 = 100uF/35V: Origin Footprint 2: X47U; Origin Footprint 1: ________Ƭ6x6; Design Item ID: ELECTRO1; Library Name: *
C34 C36 C40 C43 C48 C49 = 1206B475K500NT: 容值:4.7uF;精度:±10%;额定电压:50V;材质(温度系数):X7R;; LCSC Part Name: 4.7uF±10%50V; Supplier Part: C29823; Manufacturer: FH(风华); Supplier Footprint: 1206; JLCPCB Part Class: 基础库; Datasheet: https://atta.szlcsc.com/upload/public/pdf/source/20200305/C486355_26A10D38EF8C2A5C37091D0039909270.pdf; Supplier: LCSC; Tolerance: ±10%; Voltage Rated: 50V; Temperature Coefficient: X7R
C37 C39 C44 C52 = 104: Design Item ID: CAP; Library Name: SCH--װ--
D22 D25 D27 = SS56: Design Item ID: 1N4148; Library Name: SCH--װ--
D23 = �̹�: Origin Footprint 2: LED(С); Design Item ID: LED; Library Name: SCH--װ--
DZ1 DZ2 DZ4 = ��ѹ������SMAZ10V: Design Item ID: --ѹ------; Library Name: SCH--װ--
DZ3 = ��ָ�������RS2M: Design Item ID: --ѹ------; Library Name: SCH--װ--
L1 = 47uH/5A: Inductor; Published: 8-Jun-2000; LatestRevisionDate: 29-May-2009; LatestRevisionNote: IPC-7351 Footprint Added.; PackageReference: 0402-A; Publisher: Altium Limited; PackageDescription: Chip Inductor; Code_JEITA: 0402; Code_IEC: 1005; Origin Footprint 2: INDC1608L; Origin Footprint 3: INDC2012L; Origin Footprint 4: INDC0603L; Origin Footprint 5: INDC3216AL; Origin Footprint 6: INDC4532L; Origin Footprint 1: 电感贴片12x12; Design Item ID: Inductor; Library Name: SCH封装库
L2 = MWSA1206S-330MT: 电感值:33uH;精度:±20%;额定电流:5.5A;饱和电流(Isat):6A;类型:-;; LCSC Part Name: 33uH±20%6A; Supplier Part: C408530; Manufacturer: Sunlord(顺络); Supplier Footprint: SMD; JLCPCB Part Class: 扩展库; Datasheet: https://atta.szlcsc.com/upload/public/pdf/source/20231024/D9DB0CBBB5804BFBC9233D4A02F4216A.pdf; Supplier: LCSC; Tolerance: ±20%; Rated Current: 5.5A; Saturation Current (Isat): 6A; DC Resistance (DCR): 75mΩ
L3 = SMDRI74-330MT: 电感值:33uH;精度:±20%;额定电流:960mA;饱和电流(Isat):1.8A;类型:屏蔽电感;; LCSC Part Name: 33uH±20%1.8A; Supplier Part: C49625; Manufacturer: SXN(顺翔诺); Supplier Footprint: SMD,7.5x7.5mm; JLCPCB Part Class: 扩展库; Datasheet: https://atta.szlcsc.com/upload/public/pdf/source/20210810/6F96FDC19AA308DD2AD166FFB9640E87.pdf; Supplier: LCSC; Tolerance: ±20%; Rated Current: 960mA; Saturation Current (Isat): 1.8A; DC Resistance (DCR): 170mΩ; Type: 屏蔽电感
P24 P28-P30 = DB2ER-5.0-2P-GN: 间距:5mm;颜色:绿色;排数:1;每排PIN数:2;额定电流:15A;额定电压:630V;触头镀层:锡;; LCSC Part Name: 5mm排数:1每排P数:2; Supplier Part: C5454428; Manufacturer: DORABO(地博电气); Supplier Footprint: P=5mm; JLCPCB Part Class: 扩展库; Datasheet: https://atta.szlcsc.com/upload/public/pdf/source/20230427/39CC0BD2D36F5E0FC60100946C6C8B3A.pdf; Supplier: LCSC; Pitch: 5mm; Color: 绿色; Number of Pins: 2P; Number of Rows: 1; Number of PINs Per Row: 2; Current Rating (Max): 15A; Voltage Rating (Max): 630V; Contact Plating: 锡
Q5 Q8 Q11 Q13 = SS8050: NPN General Purpose Amplifier; Published: 8-Jun-2000; LatestRevisionDate: 15-Jan-2003; LatestRevisionNote: PCB Footprint &apos;BCY-W3/D4.7&apos; replaced; DatasheetVersion: 1997; PackageVersion: Sep-1998; PackageReference: TO-92A; Publisher: Altium Limited; PackageDescription: TO, Flat Index; 3 In-Line, Axial Leads; Body Dia. 4.5mm; Leads 0.51 x 0.48 mm (max); ComponentLink1Description: Manufacturer Link; ComponentLink1URL: http://www.fairchildsemi.com/; ComponentLink2Description: Datasheet; ComponentLink2URL: http://www.fairchildsemi.com/ds/2N%2F2N3904.pdf; Origin Footprint 2: TO-92A; Design Item ID: 2N3904; Library Name: Miscellaneous Devices; Check: true
Q6 Q9 = F50N06 (FR9024N): N-Channel Power MOSFET; Published: 8-Jun-2000; LatestRevisionDate: 17-Jul-2002; LatestRevisionNote: Re-released for DXP Platform.; DatasheetVersion: PD-9.814; PackageVersion: Feb-1997; PackageReference: TO-220AB; Publisher: Altium Limited; PackageDescription: TO, Thru-Hole, Vertical, Heatsink Mounted; 3 In-Line Leads; Pitch 2.54 mm; Note: Pin 2 is electrically connected to pin 4.; ComponentLink1Description: Manufacturer Link; ComponentLink1URL: http://www.irf.com/; Design Item ID: NMOS-2; Library Name: Miscellaneous Devices
Q7 = IRFB4110PBF: 类型:1个N沟道;漏源电压(Vdss):100V;连续漏极电流(Id):180A;导通电阻(RDS(on)@Vgs,Id):4.5mΩ@10V,75A;功率(Pd):370W;阈值电压(Vgs(th)@Id):4V@250uA;; LCSC Part Name: 1个N沟道 耐压:100V 电流:180A; Supplier Part: C2650; Manufacturer: Infineon(英飞凌); Supplier Footprint: TO-220; JLCPCB Part Class: 扩展库; Datasheet: https://atta.szlcsc.com/upload/public/pdf/source/20140820/1457707230776.pdf; Supplier: LCSC; Type: 1个N沟道; Drain Source Voltage (Vdss): 100V; Continuous Drain Current (Id): 180A; Drain Source On Resistance (RDS(on)@Vgs,Id): 4.5mΩ@10V,75A; Power Dissipation (Pd): 370W; Gate Threshold Voltage (Vgs(th)@Id): 4V@250uA; Total Gate Charge (Qg@Vgs): 210nC; Input Capacitance (Ciss@Vds): 9.62nF; Reverse Transfer Capacitance (Crss@Vds): 250pF; Operating Temperature: -55℃~+175℃
Q10 Q12 = AO3401: LCSC Part Name: P---- --ѹ:30V ----:4.2A; Supplier Part: C727156; Manufacturer: TWGMC(̨--ϼ-); JLCPCB Part Class: Extended Part; Datasheet: https://atta.szlcsc.com/upload/public/pdf/source/20200827/C727156_6E081BBEEFBC6B8FEE164CB196B0AF30.pdf; Supplier: LCSC; Type: P----; Drain Source Voltage (Vdss): 30V; Continuous Drain Current (Id): 4.2A; Power Dissipation (Pd): 350mW; Drain Source On Resistance (RDS(on)@Vgs,Id): 65m--@10V,4.2A; Gate Threshold Voltage (Vgs(th)@Id): 1.3V@250uA; Design Item ID: AO3401_C727156; Check: true
R49 = 100: Resistor; Published: 8-Jun-2000; LatestRevisionDate: 17-Jul-2002; LatestRevisionNote: Re-released for DXP Platform.; PackageReference: AXIAL-0.3; Publisher: Altium Limited; Origin Footprint 2: AXIAL-0.3; Origin Footprint 3: R0805; Origin Footprint 4: 0805R; Design Item ID: RES; Library Name: SCH--װ--
R55 R59 R67 R69 R71 R73 = 10K: Origin Footprint 2: res; Origin Footprint 3: RES2; Origin Footprint 4: AXIAL-0.4; Origin Footprint 5: 0805R; Design Item ID: res; Library Name: MYLIB
R58 R70 R74-R81 = 5.1K: Origin Footprint 2: res; Origin Footprint 3: RES2; Origin Footprint 4: AXIAL-0.4; Origin Footprint 5: 0805R; Design Item ID: res; Library Name: MYLIB
R60 R72 = 10: Resistor; Published: 8-Jun-2000; LatestRevisionDate: 17-Jul-2002; LatestRevisionNote: Re-released for DXP Platform.; PackageReference: AXIAL-0.3; Publisher: Altium Limited; Origin Footprint 2: AXIAL-0.3; Origin Footprint 3: R0805; Origin Footprint 4: 0805R; Design Item ID: RES; Library Name: SCH封装库
R61 = 44.2K: Resistor; Published: 8-Jun-2000; LatestRevisionDate: 17-Jul-2002; LatestRevisionNote: Re-released for DXP Platform.; PackageReference: AXIAL-0.3; Publisher: Altium Limited; Origin Footprint 2: AXIAL-0.3; Origin Footprint 3: R0805; Design Item ID: RES; Library Name: SCH封装库
R62 = 2.37K: Resistor; Published: 8-Jun-2000; LatestRevisionDate: 17-Jul-2002; LatestRevisionNote: Re-released for DXP Platform.; PackageReference: AXIAL-0.3; Publisher: Altium Limited; Origin Footprint 2: AXIAL-0.3; Origin Footprint 3: R0805; Design Item ID: RES; Library Name: SCH封装库
R64-R66 = Res_1210: Supplier Footprint: 1210
U18 = CD4066BM/TR: 开关电路:-;; LCSC Part Name: CMOS四双边开关; Supplier Part: C512770; Manufacturer: HGSEMI(华冠); Supplier Footprint: SOP-14; JLCPCB Part Class: 扩展库; Datasheet: https://atta.szlcsc.com/upload/public/pdf/source/20211126/BD768E4FF67D893E226722C18E7B5DB6.pdf; Supplier: LCSC
U19 = CA-IS3720LS: LCSC Part Name: CA-IS372x高速双通道数字隔离器; Supplier Part: C5121215; Manufacturer: Chipanalog(川土微); Supplier Footprint: SOIC-8; JLCPCB Part Class: 扩展库; Datasheet: https://atta.szlcsc.com/upload/public/pdf/source/20220817/B10411DCED9A45C0160465FE161A7C01.pdf; Supplier: LCSC
U20 = 74LVC1G04: Design Item ID: 74LVC1G17; Library Name: SCH--װ--
U21 = LM2576HVS-ADJ: Simple Switcher 3A Step Down Voltage Regulator; Published: 15-Apr-2002; DatasheetVersion: Jun-1999; PackageReference: TS5B; Publisher: Altium Limited; PackageDescription: D2-PAK; 5 Leads; Body 14.4 (inc. leads) x 10.4 mm (LxW max); Note: Tab is connected to GND; ComponentLink1Description: Manufacturer Link; ComponentLink1URL: http://www.national.com/; ComponentLink2Description: Datasheet; ComponentLink2URL: http://www.national.com/ds.cgi/LM/LM2576.pdf; ComponentLink3Description: URL Link1; ComponentLink3URL: http://www.national.com/pf/LM/LM2576.html; Design Item ID: LM2576S-5.0; Library Name: NSC Power Mgt Switching Regulator; Datasheet: http://www.national.com/ds.cgi/LM/LM2576.pdf
U22 = HYM2596S-12: 功能类型:降压型;输入电压:-;输出电流(最大值):-;; Supplier Part: C166696; Manufacturer: HAOYU(昊昱); Supplier Footprint: TO-263-5; JLCPCB Part Class: 扩展库; Datasheet: https://atta.szlcsc.com/upload/public/pdf/source/20180126/C166697_15169517382381308528.pdf; Supplier: LCSC; Function: 降压型; Switch tube (built-in/external): 内置
U23 U24 = B0505LS-1WR3: 100%国产化器件，高可靠性，具备ROHS、REACH、CE认证产品; Supplier Part: C909800; Manufacturer: DEXU(德旭电子); Supplier Footprint: 插件; JLCPCB Part Class: 扩展库; Datasheet: https://atta.szlcsc.com/upload/public/pdf/source/20220506/97E51FF679E86FC18F266BBBBBA200F9.pdf; Supplier: LCSC; Number of channel: 1; input voltage (Vdc): 4.5V~5.5V; Output Voltage: 5V; Output Current (Max): 200mA
U25 = 1117-3.3: Design Item ID: LM1117; Library Name: Party600
U26 = LM2596S-5.0RG_C5157156: Supplier Part: C5157156; Manufacturer: HGC(深圳汉芯); Supplier Footprint: TO-263-5; JLCPCB Part Class: 扩展库; Datasheet: https://atta.szlcsc.com/upload/public/pdf/source/20220308/5E7E021717B07C63974FB4CE30FAB155.pdf; Supplier: LCSC

## Nets
3V3: C4.2 C5.2 C6.2 C13.1 C14.1 C15.1 C48.2 C49.2 C50.2 P23.2 R5.1 R6.1 R7.1 R8.1 R19.1 R20.1 R21.1 R29.1 R31.1 R33.1 R34.1 R35.1 R36.2 R39.2 R41.2 R46.2 R82.1 U14.1(VBAT) U14.13(VDDA) U14.19(VDD_4) U14.32(VDD_1) U14.48(VDD_2) U14.64(VDD_3) U15.1(VDDA) U16.1(VDDA) U17.1(VDDA) U19.1(VDDA) U25.2(OUT) U25.4(=)
5V_DIS: C1.2 C12.1 C36.2 C37.2 H1.1 P16.1 P16.2 P17.3 Q2.2(S) R16.2 R44.2 U23.6(+VO)
5V_MCU: C20.2 C43.2 C44.2 C47.1 U18.14(VDD) U24.6(+VO) U25.3(IN)
5V_VCC: C16.2 C17.2 C18.2 C34.2 C35.2 C40.2 C46.2 C51.1 C52.2 H5.1 H5.2 L3.2 P5.1 P18.4 P19.4 P20.4 P21.4 Q10.2(S) Q12.2(S) R1.1 R2.1 R3.1 R4.1 R13.1 R14.1 R15.1 R22.1 R23.1 R24.1 R25.1 R51.2 R75.2 R79.2 U15.16(VDDB) U16.16(VDDB) U17.16(VDDB) U19.8(VDDB) U20.5(VCC) U23.1(VIN) U24.1(VIN) U26.4(FB)
12V: C23.2 C25.1 C38.1 C39.2 C41.1 C42.1 C45.2 L2.2 P27.3 P30.2 R52.2 R54.2 R56.2 R58.2 R59.1 U22.4(FEEDBACK) U26.1(VIN)
24V: C24.1 C26.2 C27.1 C28.1 C29.1 C30.1 C31.2 C32.2 C33.1 L1.2 P26.3 P29.2 P31.3 R61.2 R70.2 R71.1 U22.1(+VIN)
48V_IN: C21.1 C22.1 D17.2 D18.2 R47.2 U21.1(IN)
48V_SPN-: C19.2 D22.1 P24.1 Q7.3(S) R65.2 R66.2
PGND: C16.1 C17.1 C18.1 C21.2 C22.2 C23.1 C24.2 C26.1 C27.2 C28.2 C29.2 C30.2 C31.1 C32.1 C34.1 C35.1 C38.2 C39.1 C40.1 C41.2 C42.2 C45.1 C46.1 C51.2 C52.1 D1.2 D2.2 D3.2 D4.2 D8.1 D9.1 D10.1 D11.1 D12.1 D13.1 D14.1 D19.2 D20.1 D25.1 D27.1 DZ1.1 DZ2.1 DZ4.1 H3.1 H3.2 H4.1 H4.2 K1.1 K1.2 P1.1 P1.2 P2.1 P3.1 P4.1 P6.2 P7.2 P8.2 P9.2 P10.2 P11.2 P12.2 P22.2 P25.2 P26.1 P29.1 P30.1 P32.1 P33.1 Q4.3(E) Q6.3(S) Q9.3(S) Q11.2(E) Q13.2(E) R48.2 R53.1 R57.2 R62.1 R64.2 R65.1 R66.1 R67.1 R73.1 R76.2 R80.2 U15.9(GNDB) U16.9(GNDB) U17.9(GNDB) U19.5(GNDB) U20.3(GND) U21.3(GND) U21.5(~ON~/OFF) U22.3(GND) U22.5(ON#/OFF) U22.6(TAB) U23.2(GND) U24.2(GND) U26.3(GND) U26.5(ON/OFF) U26.6(GND)
SGND: C1.1 C2.2 C3.2 C4.1 C5.1 C6.1 C7.2 C8.2 C9.2 C10.1 C12.2 C13.2 C14.2 C15.2 C20.1 C36.1 C37.1 C43.1 C44.1 C47.2 C48.1 C49.1 C50.1 D26.2 P13.1 P14.1 P15.1 P16.3 P16.4 P17.1 P23.1 Q1.3(E) Q3.3(E) R9.2 R12.1 R18.2 R32.1 R40.2 R43.2 R45.1 U1.3 U2.3 U3.3 U4.3 U5.3 U6.3 U7.3 U8.3 U9.2(GND) U10.3 U11.3 U12.3 U13.1(GND) U14.12(VSSA) U14.18(VSS_4) U14.31(VSS_1) U14.47(VSS_2) U14.63(VSS_3) U15.8(GNDA) U16.8(GNDA) U17.8(GNDA) U18.7(VSS) U19.4(GNDA) U23.4(0V) U24.4(0V) U25.1(GND) USB_TTL1.4(GND) USB_TTL1.5(GND) USB_TTL1.6(GND)
A_LIMT: R8.2 U4.4 U14.40(PC9)
A_LO: D4.1 P5.2 U4.2
ADC: P17.2 U14.27(PB1/ADC12_IN9)
BEEP: R42.2 U14.11(PC3)
BOOT0: R32.2 U14.60(BOOT0)
BOOT1: R40.1 U14.28(PB2/BOOT1)
D+: U14.45(PA12)
D-: U14.44(PA11)
DOOR: R35.2 U12.4 U14.2(PC13-TAMPER-RTC)
EXIO: R19.2 U5.4 U14.51(PC10)
HOLD: R34.2 U11.4 U14.52(PC11)
LASER_CD: U18.3(Z1) U19.2(VI1/VO1)
LASER_CTRL: U14.26(PB0) U17.5(VI4)
LASER_OUT: R50.1 U19.7(VI1/VO1)
LASER_PO: R55.2 U17.12(VO4)
LED_SYS: D15.2 U14.55(PB3/JTDO)
M_EN_OUT: P18.1 P19.1 P20.1 P21.1 U17.10(VO6)
MA_DIR: U16.2(VI1)
MA_DIR_OUT: P21.3 U16.15(VO1)
MA_ST_OUT: P21.2 U16.14(VO2)
MA_STEP: U16.3(VI2)
MOTOR_EN: R39.1 U14.24(PC4/ADC12_IN14) U17.7(VI6)
MX_DIR: U15.2(VI1)
MX_DIR_OUT: P18.3 U15.15(VO1)
MX_ST_OUT: P18.2 U15.14(VO2)
MX_STEP: U14.22(PA6) U15.3(VI2)
MY_DIR: U14.21(PA5) U15.4(VI3)
MY_DIR_OUT: P19.3 P20.3 U15.13(VO3)
MY_ST_OUT: P19.2 P20.2 U15.12(VO4)
MY_STEP: U14.20(PA4) U15.5(VI4)
MZ_DIR: U14.17(PA3) U15.6(VI5)
MZ_DIR_OUT: H2.1 U15.11(VO5)
MZ_ST_OUT: H2.2 U15.10(VO6)
MZ_STEP: U14.16(PA2) U15.7(VI6)
NRST: C10.2 R33.2 U14.7(NRST)
PA9: U14.42(PA9)
PA10: U14.43(PA10)
PD2: U14.54(PD2)
PROBE: R31.2 U10.4 U14.10(PC2)
PUMP_CTRL: U14.25(PC5/ADC12_IN15) U17.6(VI5)
PUMP_PO: R69.2 U17.11(VO5)
PWM_COOL: U14.61(PB8/TIM4_CH3/DMA1_Ch5) U17.4(VI3)
PWM_OUT: P31.2 U17.13(VO3)
RGB_DATA1: U16.7(VI6)
RGB_DATA2: U14.50(PA15/JTDI/TIM2_CH1/DMA1_Ch2) U16.5(VI4)
RGB_OUT1: P32.2 U16.10(VO6)
RGB_OUT2: P33.2 U16.12(VO4)
RGB_P1: U14.35(PB14) U16.4(VI3)
RGB_P2: U14.36(PB15) U16.6(VI5)
RGB_PO1: R74.2 U16.13(VO3)
RGB_PO2: R78.2 U16.11(VO5)
RST: C11.2 P16.5 R29.2 U8.4 U14.8(PC0)
RUN: R20.2 U6.4 U14.53(PC12)
RXD: R27.2 R38.1 U14.59(PB7)
RXD3: P14.2 R36.1 U14.30(PB11)
SP_PWM_5V: P25.1 U17.14(VO2)
SPINDLE_CD: U18.2(Z0) U19.3(VI2/VO2)
SPINDLE_EN0: U14.33(PB12) U18.13(E0)
SPINDLE_EN1: U14.34(PB13) U18.5(E1)
SPINDLE_OUT: R48.1 U19.6(VI2/VO2) U20.2(A)
SPINDLE_PWM: R45.2 R46.1 U14.41(PA8) U17.3(VI2) U18.1(Y0) U18.4(Y1)
SPN+: C19.1 D17.1 D18.1 DZ3.2 P24.2 P28.2 R68.1
SPN_PWM: DZ1.2 Q4.2(C) R52.1 R54.1 R56.1 R57.1 R63.1
SPN_PWM_OUT: Q7.1(G) R63.2
SWCLK: P23.3 U14.49(PA14/JTCK/SWCLK)
SWDIO: P23.4 U14.46(PA13/JTMS/SWDIO)
TEST_PWM: P22.1 U17.15(VO1)
TIM4_CH4: U14.62(PB9/TIM4_CH4) U17.2(VI1)
TXD: R28.2 R37.1 U14.58(PB6)
TXD3: P14.3 U14.29(PB10)
USB_CHK: R9.1 R10.2 U14.56(PB4/JNTRST)
USB_DM: U9.3(I/O2) USB_TTL1.2(D-)
USB_DM_1: U9.4(I/O2) U13.6(UD-)
USB_DP: U9.1(I/O1) USB_TTL1.3(D+)
USB_DP_1: U9.6(I/O1) U13.5(UD+)
VCH340: Q2.3(D) U13.16(VCC)
VUSB: D5.1 D6.1 D7.1 U9.5(VBUS) USB_TTL1.1(VBUS)
X_LIMT: R5.2 U1.4 U14.37(PC6)
X_LO: D1.1 P2.2 U1.2
XTAL1: C3.1 R26.1 U14.5(OSC_IN/PD0) Y1.1(OSC1)
XTAL2: C2.1 R26.2 U14.6(OSC_OUT/PD1) Y1.2(OSC2)
Y_LIMT: R6.2 U2.4 U14.38(PC7)
Y_LO: D2.1 P3.2 U2.2
Z_LIMT: R7.2 U3.4 U14.39(PC8)
Z_LO: D3.1 P4.2 U3.2
ZERO: R21.2 U7.4 U14.9(PC1)
$1N25015: C9.1 U13.4(V3)
$1N25025: C11.1 U13.13(DTR#)
$1N25043: C7.1 R30.2 U13.7(XI) Y2.2(OSC2)
$1N25047: C8.1 R30.1 U13.8(XO) Y2.1(OSC1)
$1N25057: Q3.1(B) R42.1 R43.1
$1N25180: D15.1 R41.1
$1N25300: R1.2 U1.1
$1N25317: Q2.1(G) R17.1
$1N25319: Q1.2(C) R16.1 R17.2
$1N25342: D7.2 R18.1
$1N25345: Q1.1(B) R11.1 R12.2
$1N25354: BUZ1.1 D16.2 R44.1
$1N25355: BUZ1.2 D16.1 Q3.2(C)
$1N25359: R24.2 U11.1
$1N25456: R2.2 U2.1
$1N25466: R3.2 U3.1
$1N25476: R4.2 U4.1
$1N25486: D13.2 P11.1 U11.2
$1N25489: R14.2 U6.1
$1N25493: D9.2 P7.1 U6.2
$1N25496: R15.2 U7.1
$1N25501: D10.2 P8.1 U7.2
$1N25504: R25.2 U12.1
$1N25509: D14.2 P12.1 U12.2
$1N25512: R13.2 U5.1
$1N25517: D8.2 P6.1 U5.2
$1N25520: R22.2 U8.1
$1N25525: D11.2 K1.3 K1.4 P9.1 U8.2
$1N25567: D6.2 H1.2
$1N25569: D5.2 R10.1 R11.2
$1N25579: R23.2 U10.1
$6N26706: D20.2 L1.1 U21.2(OUT)
$6N26710: R61.1 R62.2 U21.4(FB)
$6N26736: D26.1 R82.2
$6N26743: D22.2 D23.2 DZ3.1 P28.1 Q7.2(D)
$6N26746: D23.1 R68.2
$6N26776: D24.1 R71.2
$6N26777: C33.2 D24.2 P31.1 Q9.2(D)
$6N26781: Q8.2(E) R72.2
$6N26782: DZ4.2 Q9.1(G) R72.1 R73.2
$6N26787: D21.1 R59.2
$6N26789: DZ2.2 Q6.1(G) R60.1 R67.2
$6N26790: P26.2 P27.2 R50.2 R53.2
$6N26799: D19.1 R47.1
$6N26802: Q4.1(B) R49.2 R51.1
$6N26803: R49.1 U20.4(Y)
$6N26836: Q8.3(C) R70.1
$6N26839: Q8.1(B) R69.1
$6N26845: Q5.3(C) R58.1
$6N26846: Q5.2(E) R60.2
$6N26847: Q5.1(B) R55.1
$6N26878: D27.2 L3.1 U26.2(OUTPUT)
$6N26882: D25.2 L2.1 U22.2(OUTPUT)
$6N26906: C25.2 D21.2 P27.1 Q6.2(D) R64.1
Net-(D12-2): D12.2 P10.1 U10.2
Net-(P13-2): P13.2 R27.1 U13.2(TXD)
Net-(P13-3): P13.3 R28.1 U13.3(RXD)
Net-(P15-2): P15.2 P16.6 R37.2
Net-(P15-3): P15.3 P16.8 R38.2
Net-(P32-3): P32.3 Q10.3(D)
Net-(P33-3): P33.3 Q12.3(D)
Net-(Q10-1): Q10.1(G) R77.2
Net-(Q11-1): Q11.1(B) R74.1 R76.1
Net-(Q11-3): Q11.3(C) R75.1 R77.1
Net-(Q12-1): Q12.1(G) R81.2
Net-(Q13-1): Q13.1(B) R78.1 R80.1
Net-(Q13-3): Q13.3(C) R79.1 R81.1

Not connected (* = marked no-connect by the designer): D30 1 2; D31 1 2; D32 1(K) 2(K) 3(A); D33 1 2; D35 1(K) 2(K) 3(A); D36 1 2; P16 7; U13 9(CTS#) 10(DSR#) 11(RI#) 12(DCD#) 14(RTS#) 15(R232); U14 3(PC14-OSC32_IN) 4(PC15-OSC32_OUT) 14(PA0/TIM2_CH1 DMA1_Ch2) 15(PA1) 23(PA7/SPI1_MOSI DMA1_Ch3) 57(PB5/SPI1_MOSI/DMA1_Ch3); U18 6(E2) 8(Y2) 9(Z2) 10(Z3) 11(Y3) 12(E3); U20 1(NC)

## Notes on the sheets
sheet 1
- 外接驱动器共阳
- USB转TTL
- #define X_STEP_BIT      6//9
  #define Y_STEP_BIT      2//0//4//6
  #define Z_STEP_BIT      4//0
  #define X_DIRECTION_BIT   9//7//PA7--SPI
  #define Y_DIRECTION_BIT   3//1//5//7
  #define Z_DIRECTION_BIT   5//1
- MX_DIR
- 限位开关
- 蜂鸣器
sheet 2
- Vout=1.23x(1+R2/R1)
- 48V转24V
- 48V电源输入
- 24V转12V
- 12V转5V
- 单片机LDO电源3.3V
- 软开关
- 反相
- 控制切换主轴与激光输出
- 控制灯带1//SPI+dma//PB5
- 控制灯带2//TIM2+dma//PA15
- 控制24V风机
